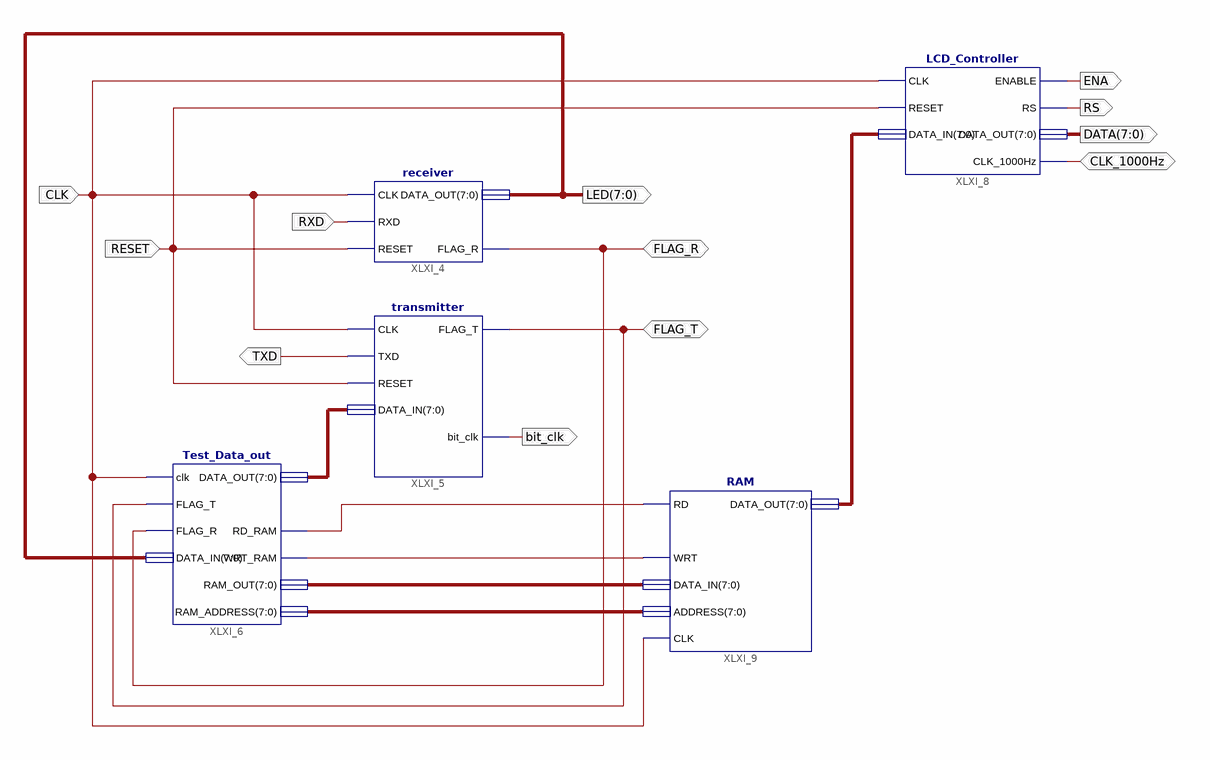
[diagram p0: schematic sheet 1]
// Xilinx ISE schematic TestSchem.sch (spartan3e) as structural Verilog: 5 symbols, 12 ports
module TestSchem (
  input  CLK,
  input  RXD,
  input  RESET,
  inout  FLAG_R,
  inout  FLAG_T,
  inout  CLK_1000Hz,
  output [7:0] LED,
  output TXD,
  output bit_clk,
  output ENA,
  output RS,
  output [7:0] DATA
);

  wire XLXN_17, XLXN_18;
  wire [7:0] XLXN_4, XLXN_19, XLXN_20, XLXN_38;

  receiver XLXI_4 (.CLK(CLK), .RXD(RXD), .RESET(RESET), .FLAG_R(FLAG_R), .DATA_OUT(LED));
  transmitter XLXI_5 (.CLK(CLK), .RESET(RESET), .DATA_IN(XLXN_4), .FLAG_T(FLAG_T), .TXD(TXD), .bit_clk(bit_clk));
  Test_Data_out XLXI_6 (
    .FLAG_T(FLAG_T), .clk(CLK), .DATA_OUT(XLXN_4), .FLAG_R(FLAG_R), .DATA_IN(LED), .RD_RAM(XLXN_17),
    .WRT_RAM(XLXN_18), .RAM_OUT(XLXN_20), .RAM_ADDRESS(XLXN_19));
  RAM XLXI_9 (.RD(XLXN_17), .WRT(XLXN_18), .DATA_IN(XLXN_20), .ADDRESS(XLXN_19), .DATA_OUT(XLXN_38), .CLK(CLK));
  LCD_Controller XLXI_8 (
    .CLK(CLK), .RESET(RESET), .DATA_IN(XLXN_38), .CLK_1000Hz(CLK_1000Hz), .ENABLE(ENA), .RS(RS),
    .DATA_OUT(DATA));
endmodule
